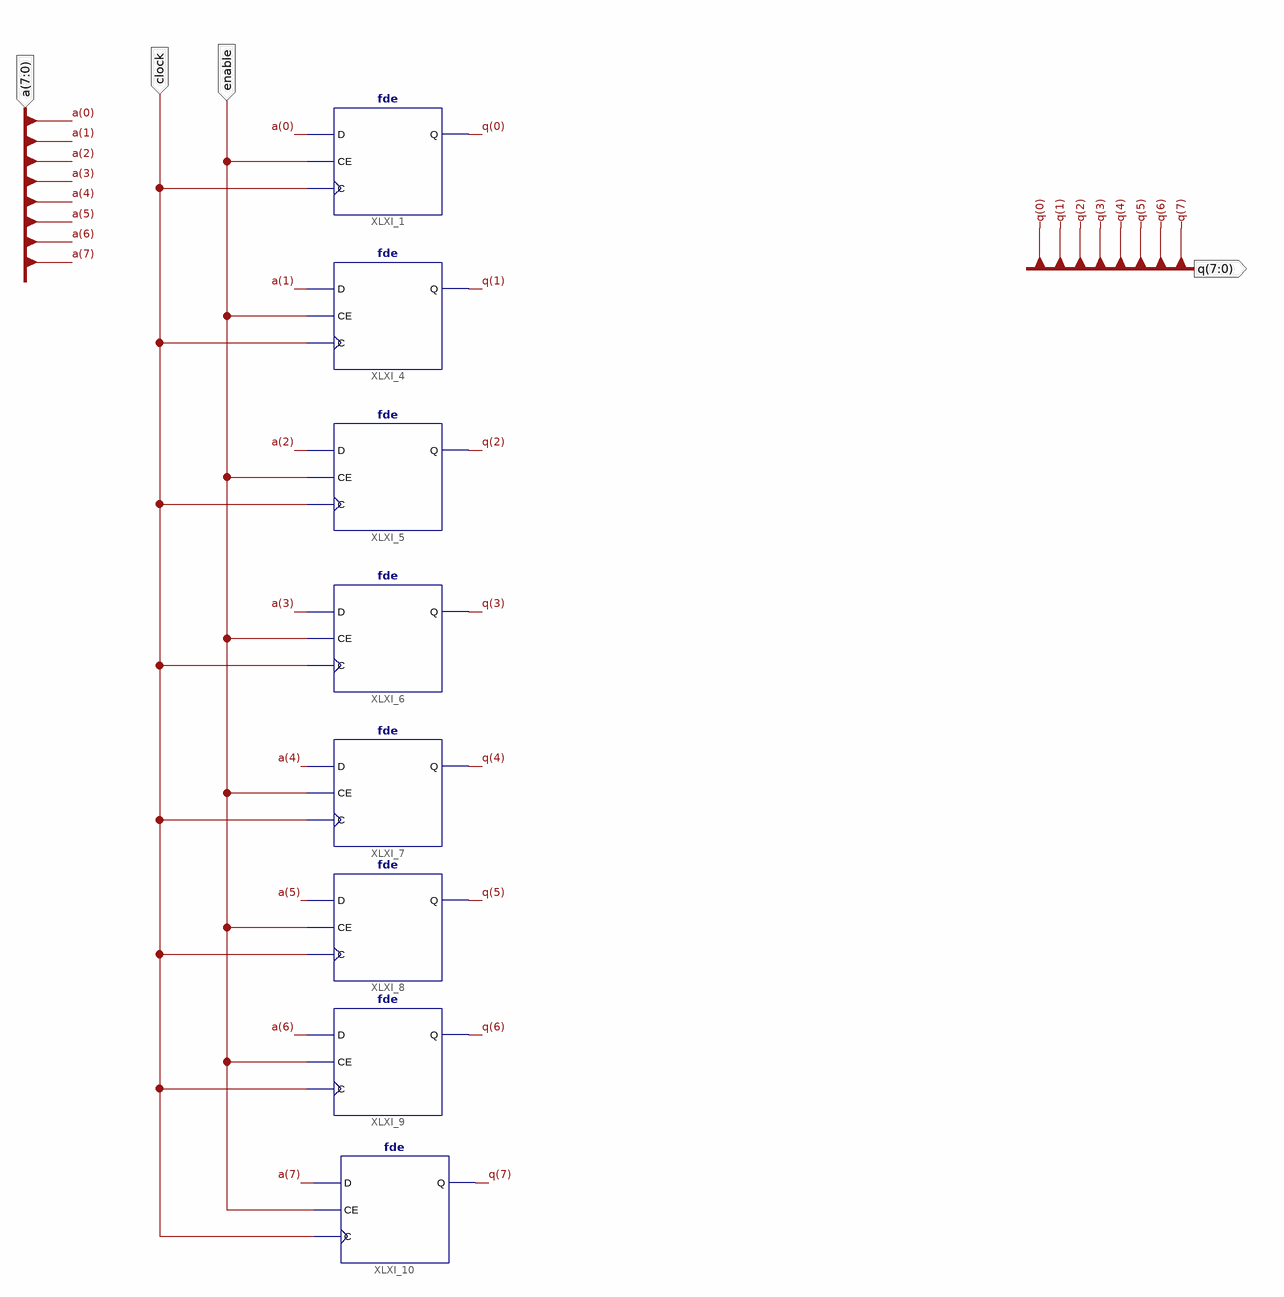
[diagram p0: schematic sheet 1]
// Xilinx ISE schematic register8Bit.sch (spartan6) as structural Verilog: 8 symbols, 4 ports
module register8Bit (
  input  [7:0] a,
  input  enable,
  input  clock,
  output [7:0] q
);

  fde XLXI_1 (.C(clock), .CE(enable), .D(a[0]), .Q(q[0]));
  fde XLXI_4 (.C(clock), .CE(enable), .D(a[1]), .Q(q[1]));
  fde XLXI_5 (.C(clock), .CE(enable), .D(a[2]), .Q(q[2]));
  fde XLXI_6 (.C(clock), .CE(enable), .D(a[3]), .Q(q[3]));
  fde XLXI_7 (.C(clock), .CE(enable), .D(a[4]), .Q(q[4]));
  fde XLXI_8 (.C(clock), .CE(enable), .D(a[5]), .Q(q[5]));
  fde XLXI_9 (.C(clock), .CE(enable), .D(a[6]), .Q(q[6]));
  fde XLXI_10 (.C(clock), .CE(enable), .D(a[7]), .Q(q[7]));
endmodule
